# EAGLE design ADS1299_4_Feather (EAGLE 9.6.2)
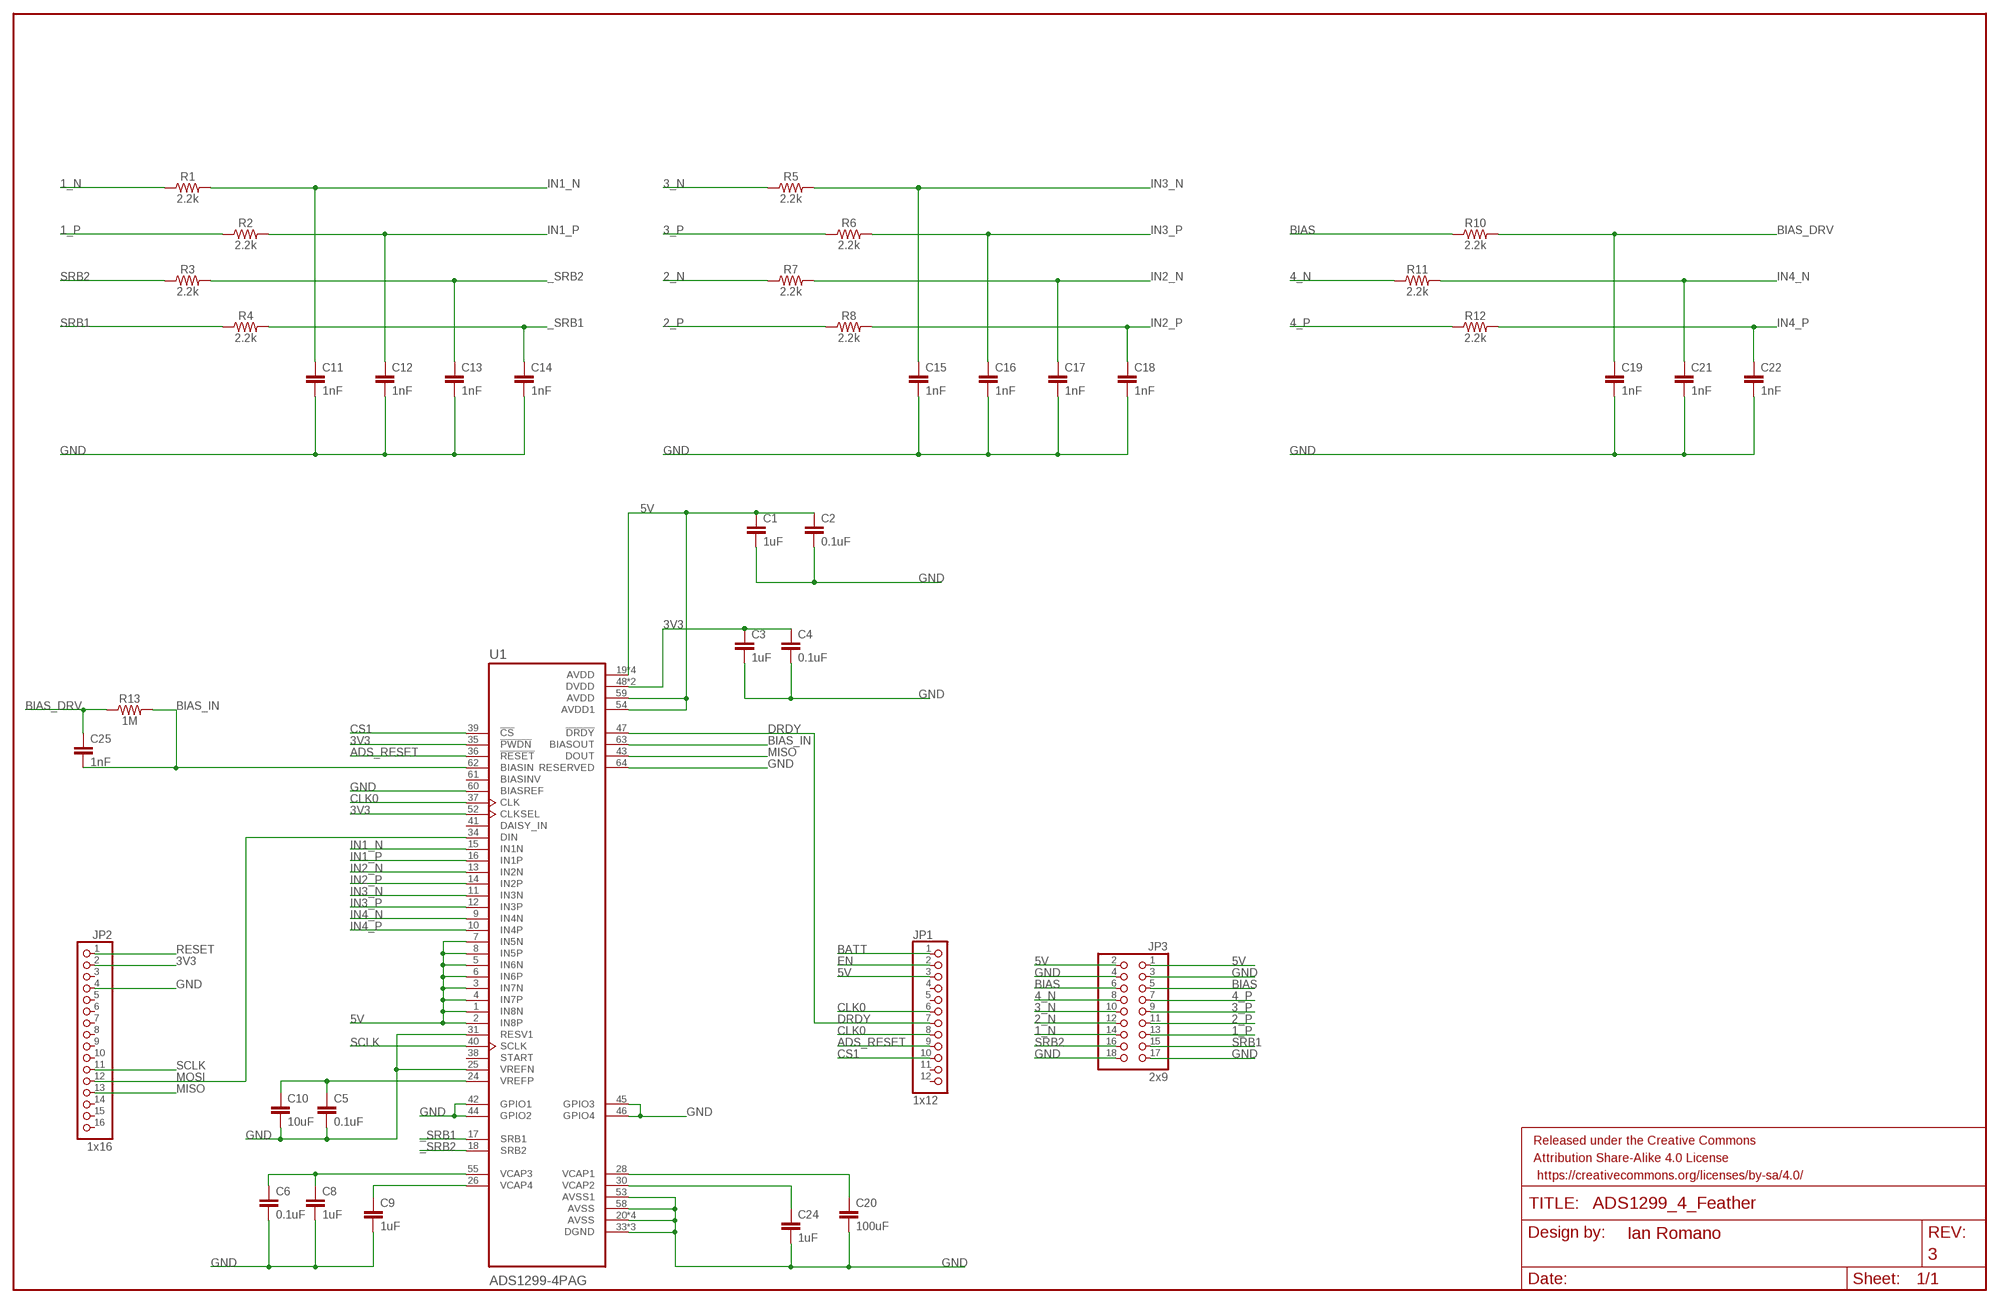
[diagram p0: schematic, sheet 1]

## Parts
C1  1uF  10UF-0805-10V-10%  [0805]
C2  0.1uF  10UF-0805-10V-10%  [0805]
C3  1uF  10UF-0805-10V-10%  [0805]
C4  0.1uF  10UF-0805-10V-10%  [0805]
C5  0.1uF  10UF-0805-10V-10%  [0805]
C6  0.1uF  10UF-0805-10V-10%  [0805]
C8  1uF  10UF-0805-10V-10%  [0805]
C9  1uF  10UF-0805-10V-10%  [0805]
C10  10uF  10UF-0805-10V-10%  [0805]
C11  1nF  10UF-0805-10V-10%  [0805]
C12  1nF  10UF-0805-10V-10%  [0805]
C13  1nF  10UF-0805-10V-10%  [0805]
C14  1nF  10UF-0805-10V-10%  [0805]
C15  1nF  10UF-0805-10V-10%  [0805]
C16  1nF  10UF-0805-10V-10%  [0805]
C17  1nF  10UF-0805-10V-10%  [0805]
C18  1nF  10UF-0805-10V-10%  [0805]
C19  1nF  10UF-0805-10V-10%  [0805]
C20  100uF  10UF-0805-10V-10%  [0805]
C21  1nF  10UF-0805-10V-10%  [0805]
C22  1nF  10UF-0805-10V-10%  [0805]
C24  1uF  10UF-0805-10V-10%  [0805]
C25  1nF  10UF-0805-10V-10%  [0805]
FRAME1  FRAME-LEDGER  [CREATIVE_COMMONS]
JP1  1x12  MICROBUILDER_HEADER-1X1276MIL  [MICROBUILDER_1X12_ROUND_76MIL]
JP2  1x16  MICROBUILDER_HEADER-1X16_76MIL  [MICROBUILDER_1X16_ROUND_76MIL]
JP3  2x9  PINHD-2X9-BIG  [2X09-BIG]
R1  2.2k  RESISTOR0805  [0805]
R2  2.2k  RESISTOR0805  [0805]
R3  2.2k  RESISTOR0805  [0805]
R4  2.2k  RESISTOR0805  [0805]
R5  2.2k  RESISTOR0805  [0805]
R6  2.2k  RESISTOR0805  [0805]
R7  2.2k  RESISTOR0805  [0805]
R8  2.2k  RESISTOR0805  [0805]
R10  2.2k  RESISTOR0805  [0805]
R11  2.2k  RESISTOR0805  [0805]
R12  2.2k  RESISTOR0805  [0805]
R13  1M  RESISTOR0805  [0805]
U1  ADS1299-4PAG  [QFP50P1200X1200X120-64N]

## Nets
1_N [DiffPairs]: JP3.14 R1.1
1_P [DiffPairs]: JP3.13 R2.1
2_N [DiffPairs]: JP3.12 R7.1
2_P [DiffPairs]: JP3.11 R8.1
3_N [DiffPairs]: JP3.10 R5.1
3_P [DiffPairs]: JP3.9 R6.1
3V3 [PWR]: C3.1 C4.1 JP2.2 U1.35(!PWDN) U1.48(DVDD) U1.50(DVDD) U1.52(CLKSEL)
4_N [DiffPairs]: JP3.8 R11.1
4_P [DiffPairs]: JP3.7 R12.1
5V [PWR]: C1.1 C2.1 JP1.3 JP3.1 JP3.2 U1.1(IN8N) U1.2(IN8P) U1.3(IN7N) U1.4(IN7P) U1.5(IN6N) U1.6(IN6P) U1.7(IN5N) U1.8(IN5P) U1.19(AVDD) U1.21(AVDD) U1.22(AVDD) U1.54(AVDD1) U1.56(AVDD) U1.59(AVDD)
_SRB1: C14.1 R4.2 U1.17(SRB1)
_SRB2: C13.1 R3.2 U1.18(SRB2)
ADS_RESET: JP1.9 U1.36(!RESET)
BATT: JP1.1
BIAS: JP3.5 JP3.6 R10.1
BIAS_DRV: C19.1 C25.1 R10.2 R13.1
BIAS_IN: C25.2 R13.2 U1.62(BIASIN) U1.63(BIASOUT)
CLK0: JP1.6 JP1.8 U1.37(CLK)
CS1: JP1.10 U1.39(!CS)
DRDY: JP1.7 U1.47(!DRDY)
EN: JP1.2
GND [PWR]: C1.2 C2.2 C3.2 C4.2 C5.2 C6.2 C8.2 C9.2 C10.2 C11.2 C12.2 C13.2 C14.2 C15.2 C16.2 C17.2 C18.2 C19.2 C20.2 C21.2 C22.2 C24.2 JP2.4 JP3.3 JP3.4 JP3.17 JP3.18 U1.20(AVSS) U1.23(AVSS) U1.25(VREFN) U1.31(RESV1) U1.32(AVSS) U1.33(DGND) U1.42(GPIO1) U1.44(GPIO2) U1.45(GPIO3) U1.46(GPIO4) U1.49(DGND) U1.51(DGND) U1.53(AVSS1) U1.57(AVSS) U1.58(AVSS) U1.60(BIASREF) U1.64(RESERVED)
IN1_N [DiffPairs]: C11.1 R1.2 U1.15(IN1N)
IN1_P [DiffPairs]: C12.1 R2.2 U1.16(IN1P)
IN2_N [DiffPairs]: C17.1 R7.2 U1.13(IN2N)
IN2_P [DiffPairs]: C18.1 R8.2 U1.14(IN2P)
IN3_N [DiffPairs]: C15.1 R5.2 U1.11(IN3N)
IN3_P [DiffPairs]: C16.1 R6.2 U1.12(IN3P)
IN4_N [DiffPairs]: C21.1 R11.2 U1.9(IN4N)
IN4_P [DiffPairs]: C22.1 R12.2 U1.10(IN4P)
MISO: JP2.13 U1.43(DOUT)
MOSI: JP2.12 U1.34(DIN)
N$1: C5.1 C10.1 U1.24(VREFP)
N$3: C24.1 U1.30(VCAP2)
N$4: C6.1 C8.1 U1.55(VCAP3)
N$5: C20.1 U1.28(VCAP1)
N$6: C9.1 U1.26(VCAP4)
RESET: JP2.1
SCLK: JP2.11 U1.40(SCLK)
SRB1: JP3.15 R4.1
SRB2: JP3.16 R3.1
Unconnected: JP1.4 JP1.5 JP1.11 JP1.12 JP2.3 JP2.5 JP2.6 JP2.7 JP2.8 JP2.9 JP2.10 JP2.14 JP2.15 JP2.16 U1.38(START) U1.41(DAISY_IN) U1.61(BIASINV)

## Library data of the parts
C1-C6 C8 C9 C11-C22 C24 C25 = SparkFun-Capacitors:10UF: 10.0µF ceramic capacitors A capacitor is a passive two-terminal electrical component used to store electrical energy temporarily in an electric field.; PROD_ID: CAP-11330; VALUE: 10uF
C10 = SparkFun-Capacitors:10UF: 10.0µF ceramic capacitors A capacitor is a passive two-terminal electrical component used to store electrical energy temporarily in an electric field.; PROD_ID: CAP-11330
FRAME1 = SparkFun-Aesthetics:FRAME-LEDGER: Schematic Frame - Ledger Standard 11x14 US Ledger frame; DESIGNER: Ian Romano; REV: 3
JP1 = Proto FeatherWing:MICROBUILDER_HEADER-1X12
JP2 = Proto FeatherWing:MICROBUILDER_HEADER-1X16: PIN HEADER
JP3 = adafruit:PINHD-2X9: PIN HEADER With larger annulars
R1-R8 R10-R13 = SparkFun-Resistors:RESISTOR: Generic Resistor Package
U1 = ADS1299-4PAG:ADS1299-4PAG: Check prices <https://pricing.snapeda.com/search/part/ADS1299-4PAG/?ref=eda>; AVAILABILITY: Warning; DESCRIPTION: Low-Noise, 4-Channel, 24-Bit Analog-to-Digital Converter for Biopotential Measurements 64-TQFP -40 to 85; MF: Texas Instruments; MP: ADS1299-4PAG; PACKAGE: TQFP-64 Texas Instruments; PRICE: None; PURCHASE-URL: https://pricing.snapeda.com/search/part/ADS1299-4PAG/?ref=eda

## Net classes
0 default: width 0.152 mm, drill 0.305 mm, clearance 0.152 mm
1 DiffPairs: width 0.152 mm, drill 0.305 mm, clearance 0.152 mm
2 PWR: width 0.203 mm, drill 0.305 mm, clearance 0.203 mm

## Board
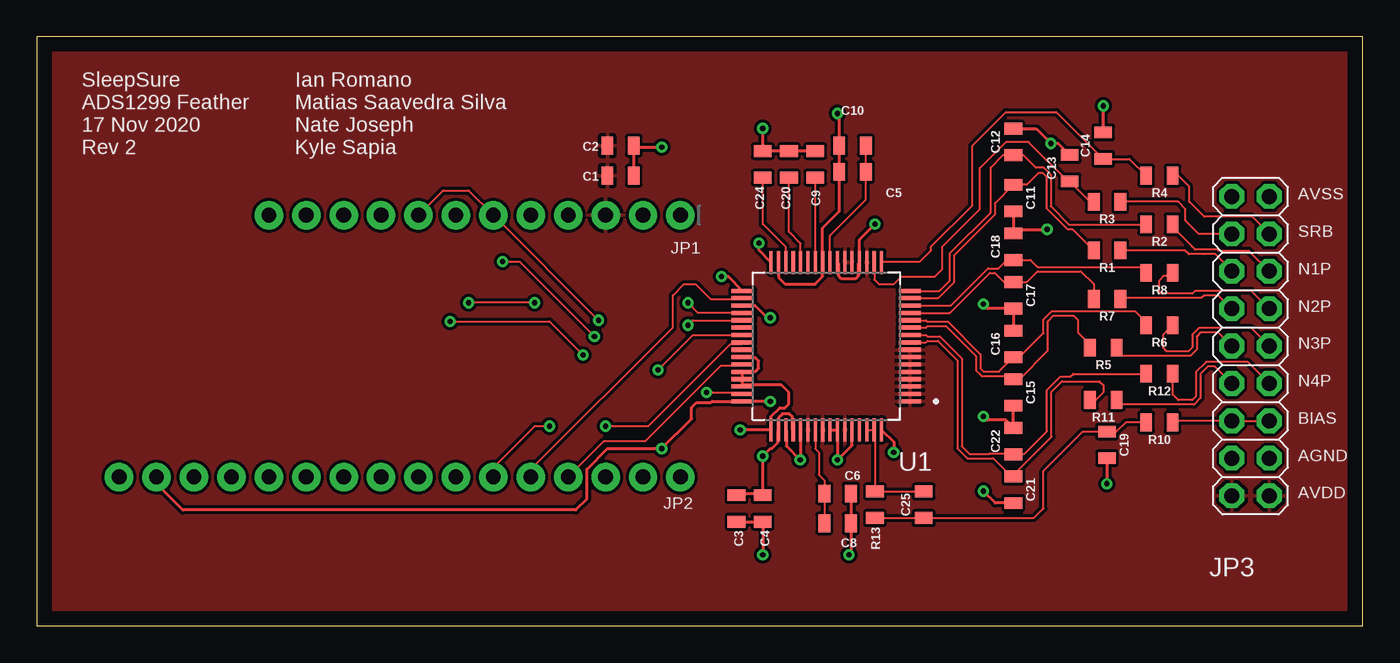
[diagram p1: board, top side]
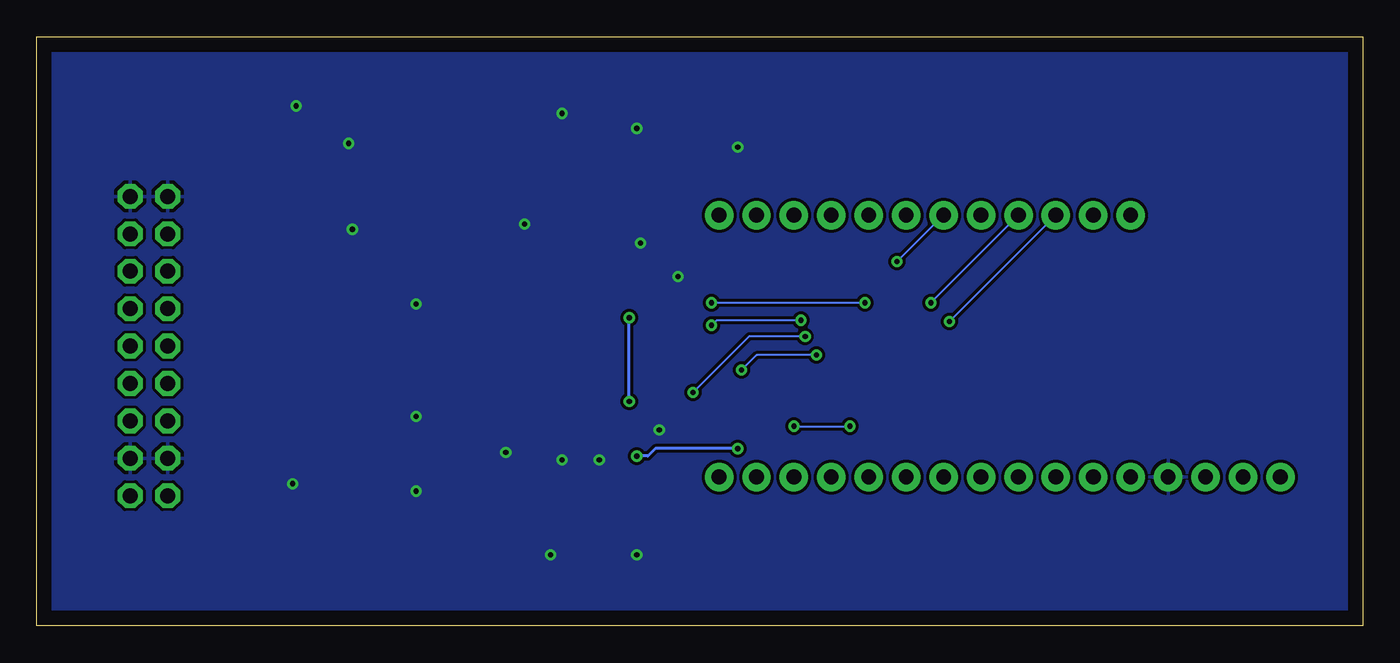
[diagram p2: board, bottom side, seen from below]

Size 90 x 40 mm. Coordinates in mm from the lower left corner, seen from the top.
Outline: 0,0 90,0 90,40 0,40 0,0
Copper layers (1*16): Top 0.035mm / dielectric 1.5mm / Bottom 0.035mm
Design rules "default *": minimum track width 6mil, minimum drill 0.35mm, track to track 6mil, track to pad 6mil, pad to pad 6mil, via to via 6mil, smd to smd 6mil, copper to edge 40mil, drill to drill 6mil, minimum pad ring 10mil, minimum via ring 8mil, stop-mask expansion 4mil, vias tented up to drill 0mil, thermal gap 10mil

### Footprints (pad centres in the part's own frame; a part is rotated, then mirrored left to right if it is on the bottom)
0805 = smd 0.8 x 1.2: 1 -0.9,0; 2 0.9,0
MICROBUILDER_1X12_ROUND_76MIL = drill 1 pad 1.93: 1 -13.97,0; 2 -11.43,0; 3 -8.89,0; 4 -6.35,0; 5 -3.81,0; 6 -1.27,0; 7 1.27,0; 8 3.81,0; 9 6.35,0; 10 8.89,0; 11 11.43,0; 12 13.97,0
MICROBUILDER_1X16_ROUND_76MIL = drill 1 pad 1.93: 1 -19.05,0; 2 -16.51,0; 3 -13.97,0; 4 -11.43,0; 5 -8.89,0; 6 -6.35,0; 7 -3.81,0; 8 -1.27,0; 9 1.27,0; 10 3.81,0; 11 6.35,0; 12 8.89,0; 13 11.43,0; 14 13.97,0; 15 16.51,0; 16 19.05,0
2X09-BIG = drill 1.016 pad 1.676 octagon: 1 -10.16,-1.27; 2 -10.16,1.27; 3 -7.62,-1.27; 4 -7.62,1.27; 5 -5.08,-1.27; 6 -5.08,1.27; 7 -2.54,-1.27; 8 -2.54,1.27; 9 0,-1.27; 10 0,1.27; 11 2.54,-1.27; 12 2.54,1.27; 13 5.08,-1.27; 14 5.08,1.27; 15 7.62,-1.27; 16 7.62,1.27; 17 10.16,-1.27; 18 10.16,1.27
QFP50P1200X1200X120-64N = smd 1.56 x 0.28: 1 -5.68,3.75; 2 -5.68,3.25; 3 -5.68,2.75; 4 -5.68,2.25; 5 -5.68,1.75; 6 -5.68,1.25; 7 -5.68,0.75; 8 -5.68,0.25; 9 -5.68,-0.25; 10 -5.68,-0.75; 11 -5.68,-1.25; 12 -5.68,-1.75; 13 -5.68,-2.25; 14 -5.68,-2.75; 15 -5.68,-3.25; 16 -5.68,-3.75; 33 5.68,-3.75; 34 5.68,-3.25; 35 5.68,-2.75; 36 5.68,-2.25; 37 5.68,-1.75; 38 5.68,-1.25; 39 5.68,-0.75; 40 5.68,-0.25; 41 5.68,0.25; 42 5.68,0.75; 43 5.68,1.25; 44 5.68,1.75; 45 5.68,2.25; 46 5.68,2.75; 47 5.68,3.25; 48 5.68,3.75 | smd 0.28 x 1.56: 17 -3.75,-5.68; 18 -3.25,-5.68; 19 -2.75,-5.68; 20 -2.25,-5.68; 21 -1.75,-5.68; 22 -1.25,-5.68; 23 -0.75,-5.68; 24 -0.25,-5.68; 25 0.25,-5.68; 26 0.75,-5.68; 27 1.25,-5.68; 28 1.75,-5.68; 29 2.25,-5.68; 30 2.75,-5.68; 31 3.25,-5.68; 32 3.75,-5.68; 49 3.75,5.68; 50 3.25,5.68; 51 2.75,5.68; 52 2.25,5.68; 53 1.75,5.68; 54 1.25,5.68; 55 0.75,5.68; 56 0.25,5.68; 57 -0.25,5.68; 58 -0.75,5.68; 59 -1.25,5.68; 60 -1.75,5.68; 61 -2.25,5.68; 62 -2.75,5.68; 63 -3.25,5.68; 64 -3.75,5.68

### Placement (x,y rotation side)
C1  39.62,30.58 0 top
C2  39.62,32.61 0 top
C3  47.5,7.97 270 top
C4  49.28,7.97 270 top
C5  55.37,30.83 180 top
C6  54.36,8.99 0 top
C8  54.36,6.95 0 top
C9  52.83,31.34 90 top
C10  55.37,32.61 180 top
C11  66.29,29.05 270 top
C12  66.29,32.86 90 top
C13  70.1,31.08 90 top
C14  72.39,32.61 90 top
C15  66.29,15.84 270 top
C16  66.29,19.15 90 top
C17  66.29,22.45 270 top
C18  66.29,25.75 90 top
C19  72.64,12.29 270 top
C20  51.05,31.34 90 top
C21  66.29,9.24 270 top
C22  66.29,12.54 90 top
C24  49.28,31.34 90 top
C25  60.2,8.22 90 top
FRAME1  0.14,50.3 0 top  (outside the outline)
JP1  29.72,27.89 180 top
JP2  24.64,10.11 0 top
JP3  82.39,19 90 top
R1  72.64,25.5 180 top
R2  76.2,27.27 180 top
R3  72.64,28.8 180 top
R4  76.2,30.58 180 top
R5  72.39,18.89 180 top
R6  76.2,20.42 180 top
R7  72.64,22.19 180 top
R8  76.2,23.97 180 top
R10  76.2,13.81 180 top
R11  72.39,15.34 180 top
R12  76.2,17.11 180 top
R13  56.9,8.22 90 top
U1  53.59,19 180 top

### Tracks (layer width: path | path; a pad name or v marks a point on that pad's centre or on a via)
1_N
  Top 0.152: JP3.14 81.12,24.13 80.01,25.24 79.27,25.24 78.19,25.24 77.94,25.5 R1.1
1_P
  Top 0.152: JP3.13 82.28,25.46 80.23,25.46 80.13,25.55 78.62,25.55 78.42,25.75 | R2.1 77.1,27.07 78.42,25.75 | 78.42,25.75
2_N
  Top 0.152: JP3.12 80.21,22.45 79.25,22.45 79.06,22.26 73.61,22.26 R7.1
2_P
  Top 0.152: JP3.11 82.45,22.75 78.61,22.75 78.43,22.57 76.33,22.57 76.2,22.7 76.2,23.46 76.51,23.77 77.1,23.77 R8.1
3_N
  Top 0.152: JP3.10 80.21,19.91 78.99,19.91 78.74,19.65 78.74,18.77 78.31,18.33 73.65,18.33 73.29,18.69 R5.1
3_P
  Top 0.152: JP3.9 82.45,20.21 78.87,20.21 78.44,19.78 78.44,18.89 78.18,18.64 76.71,18.64 76.45,18.89 76.45,19.77 R6.1
3V3  (via drill 0.35)
  Top 0.203: v49.78,15.25 U1.48 45.84,15.25 45.75,15.16 44.78,15.16 44.45,14.83 44.45,14.07 v42.42,12.03 38.74,12.03 37.34,10.64 37.34,8.64 36.58,7.87 9.91,7.87 8.13,9.65 JP2.2 | U1.52 51.29,13.38 51.29,14.21 51.09,14.4 50.6,14.4 50.34,14.15 U1.50 50.29,13.27 50.29,12.43 49.89,12.03 49.78,12.03 v49.28,11.53 49.28,8.99 | v49.78,20.92 49.57,20.92 48.74,21.75 U1.35 | C4.1 49.28,8.99 | C3.1 47.61,8.99 49.28,8.99
  Bottom 0.203: v42.42,12.03 48.01,12.03 48.51,11.53 v49.28,11.53 | v49.78,15.25 v49.78,20.92
4_N
  Top 0.152: JP3.8 79.96,17.62 79.5,17.62 78.99,17.11 78.99,15.46 78.56,15.03 73.59,15.03 R11.1
4_P
  Top 0.152: JP3.7 82.19,17.93 79.38,17.93 78.69,17.24 78.69,15.59 78.44,15.34 77.47,15.34 77.1,15.71 R12.1
5V
  pour Top: -0.25,40.39 -0.25,-0.25 90.42,-0.25 90.42,40.39
_SRB1
  Top 0.152: U1.17 57.4,24.73 59.94,24.73 60.71,25.5 60.71,25.75 63.5,28.54 63.5,32.61 65.79,34.89 69.2,34.89 C14.1 74.17,31.71 R4.2
_SRB2
  Top 0.152: U1.18 56.84,23.52 57.15,23.21 58.17,23.21 58.67,23.72 60.96,23.72 61.47,24.23 61.47,25.75 64.01,28.29 64.01,31.08 65.79,32.86 67.31,32.86 69.99,30.18 C13.1 71.49,28.8 R3.2
ADS_RESET  (via drill 0.35)
  Top 0.152: U1.36 44.89,21.25 v44.2,21.94 | v33.78,21.94 v29.32,21.94
  Bottom 0.152: v44.2,21.94 v33.78,21.94 | v29.32,21.94 JP1.9
BIAS
  Top 0.152: JP3.5 JP3.6 77.21,13.92 R10.1
BIAS_DRV
  Top 0.152: R10.2 73.91,13.81 73.29,13.19 C19.1 71,13.19 68.33,10.51 68.33,7.97 67.68,7.32 C25.1 R13.1
BIAS_IN
  Top 0.152: U1.62 U1.63 56.9,13.27 R13.2 C25.2
CLK0  (via drill 0.35)
  Top 0.152: v38.13,20.75 JP1.6 29.32,29.56 27.58,29.56 JP1.8 | v44.2,20.42 44.53,20.75 U1.37
  Bottom 0.152: v38.13,20.75 43.86,20.75 v44.2,20.42
CS1  (via drill 0.35)
  Top 0.152: v42.16,17.37 44.55,19.75 U1.39 | v28.05,20.67 34.8,20.67 v37.08,18.38
  Bottom 0.152: JP1.10 v28.05,20.67 | v37.08,18.38 41.15,18.38 v42.16,17.37
DRDY  (via drill 0.35)
  Top 0.152: v37.85,19.65 32.77,24.73 v31.6,24.73 | v45.47,15.84 v45.48,15.83 47.83,15.83 U1.47
  Bottom 0.152: JP1.7 v31.6,24.73 | v37.85,19.65 41.66,19.65 v45.47,15.84
GND  (via drill 0.35)
  Top 0.203: U1.64 58.17,12.5 v58.17,11.78 | U1.57 U1.58 54.34,11.28 v54.36,11.27 55.34,12.26 U1.60 | U1.51 50.88,13.28 50.88,12.21 v51.82,11.27 51.84,11.3 U1.53 | U1.23 54.4,24.62 54.4,23.79 54.6,23.59 55.59,23.59 55.79,23.79 55.79,24.62 U1.20 55.84,26.22 v56.9,27.27 | U1.32 49.02,25.5 v49.02,26 | U1.33 46.95,23.72 v46.48,23.72 | v47.75,13.3 49.83,13.3 U1.49 49.84,14.22 50.43,14.81 50.78,14.81 51.05,15.08 51.05,15.84 50.55,16.35 47.91,16.35 | U1.46 47.91,16.35 | 47.91,16.35 U1.45 U1.44 47.95,17.29 48.78,17.29 49,17.5 49,18 48.8,18.2 47.97,18.2 U1.42 | C12.2 67.84,33.76 v68.83,32.77 69.32,32.77 C13.2 | C14.2 v72.39,35.31 | C11.2 C18.2 66.57,26.92 v68.58,26.92 | C16.2 C17.2 64.56,21.55 v64.26,21.84 | C15.2 C22.2 65.77,13.97 64.52,13.97 v64.26,14.22 | C21.2 65.07,8.34 v64.26,9.14 | C19.2 v72.64,9.65 | C6.2 C8.2 55.26,4.96 v55.12,4.83 | C3.2 C4.2 v49.28,4.83 | C9.2 C20.2 C24.2 v49.28,33.78 | C1.2 C2.2 40.62,32.51 v42.42,32.51 | U1.31 50.34,23.67 50.8,23.21 52.83,23.21 53.34,23.72 U1.25 53.34,27.02 54.47,28.15 C5.2 C10.2 54.47,34.68 v54.36,34.8
  pour Bottom: -0.51,40.64 -0.51,-0.51 90.93,-0.51 90.93,40.64
IN1_N
  Top 0.152: U1.15 61.19,22.25 62.28,23.34 62.28,25.18 65.05,27.95 65.05,28.71 C11.1 67.2,29.95 67.26,30.02 67.98,30.73 68.31,30.73 68.53,30.51 68.53,28.37 69.98,26.92 70.32,26.92 R1.2
IN1_P
  Top 0.152: U1.16 61.26,22.75 61.98,23.46 61.98,25.3 64.75,28.08 64.75,31.12 65.59,31.96 C12.1 66.97,31.96 67.82,31.11 68.36,31.11 68.83,30.63 68.83,28.5 70.1,27.23 75.25,27.23 R2.2
IN2_N
  Top 0.152: U1.13 61.97,21.25 64.69,23.97 65.02,23.97 65.65,23.35 C17.1 67.2,23.35 67.92,24.07 70.87,24.07 71.74,23.2 R7.2
IN2_P
  Top 0.152: U1.14 62.04,21.75 64.57,24.28 65.27,24.28 65.84,24.85 C18.1 67.45,24.85 67.92,24.38 75.09,24.38 75.3,24.17 R8.2
IN3_N
  Top 0.152: 66.55,16.74 C15.1 66.01,16.74 65.79,16.97 | 66.55,16.74 66.69,16.74 68.63,18.68 68.63,20.67 69.02,21.06 70.38,21.06 70.67,20.77 70.67,19.91 71.49,19.09 R5.2 | U1.11 60.36,20.25 60.46,20.35 61.72,20.35 63.75,18.32 63.75,17.35 64.05,17.06 | 64.05,17.06 | 64.05,17.06 64.14,16.97 65.79,16.97 | 65.79,16.97 66.33,16.97 66.55,16.74
IN3_P
  Top 0.152: R6.2 75.3,20.62 74.55,21.36 68.89,21.36 68.33,20.8 68.33,19.88 66.69,18.25 C16.1 65.32,17.27 64.26,17.27 64.06,17.48 64.06,18.44 61.85,20.65 60.46,20.65 60.36,20.75 U1.12
IN4_N
  Top 0.152: R11.2 71.88,15.34 72.39,15.84 72.39,16.35 72.14,16.61 69.6,16.61 68.89,15.89 68.89,12.84 66.29,10.25 C21.1 66.15,10.14 64.92,11.37 63.18,11.37 62.48,12.07 62.48,18.03 61.17,19.35 60.46,19.35 60.36,19.25 U1.9
IN4_P
  Top 0.152: R12.2 70.35,17.11 70.17,16.93 69.48,16.93 68.58,16.02 68.58,13.21 67.01,11.64 C22.1 66.26,11.68 64.65,11.68 64.64,11.68 63.3,11.68 62.79,12.19 62.79,18.16 61.3,19.65 60.46,19.65 60.36,19.75 U1.10
MISO
  Top 0.152: JP2.13 38.5,12.54 41.31,12.54 46.43,17.67 47.83,17.67 U1.43
MOSI
  Top 0.152: JP2.12 33.53,10.62 43.18,20.27 43.18,22.45 43.94,23.21 44.7,23.21 45.72,22.19 47.86,22.19 U1.34
N$1
  Top 0.152: U1.24 53.84,26.51 56.27,28.94 C5.1 C10.1
N$3
  Top 0.152: U1.30 50.84,25.71 49.28,27.27 C24.1
N$4
  Top 0.152: U1.55 52.84,12.02 53.09,11.78 53.09,10.26 53.46,9.89 C6.1 C8.1
N$5
  Top 0.152: U1.28 51.84,25.98 51.05,26.77 C20.1
N$6
  Top 0.152: U1.26 52.84,30.43 C9.1
SCLK  (via drill 0.35)
  Top 0.152: U1.40 47.78,19.12 47.06,19.12 41.5,13.56 v38.61,13.56 | v34.8,13.56 33.78,13.56 30.99,10.76 JP2.11
  Bottom 0.152: v38.61,13.56 v34.8,13.56
SRB1
  Top 0.152: JP3.15 82.5,27.78 79.25,27.78 78.23,28.8 78.23,29.81 77.47,30.58 R4.1
SRB2
  Top 0.152: JP3.16 78.89,26.62 77.98,27.53 77.98,28.29 77.47,28.8 R3.1

### Text on the board
tSilk: SleepSure / ADS1299 Feather / 17 Nov 2020 / Rev 2 | Ian Romano / Matias Saavedra Silva / Nate Joseph / Kyle Sapia | AVSS / SRB / N1P / N2P / N3P / N4P / BIAS / AGND / AVDD